# Altium schematic sheet OZ440-SE100-CAR003_sheet17.SchDoc
size A3
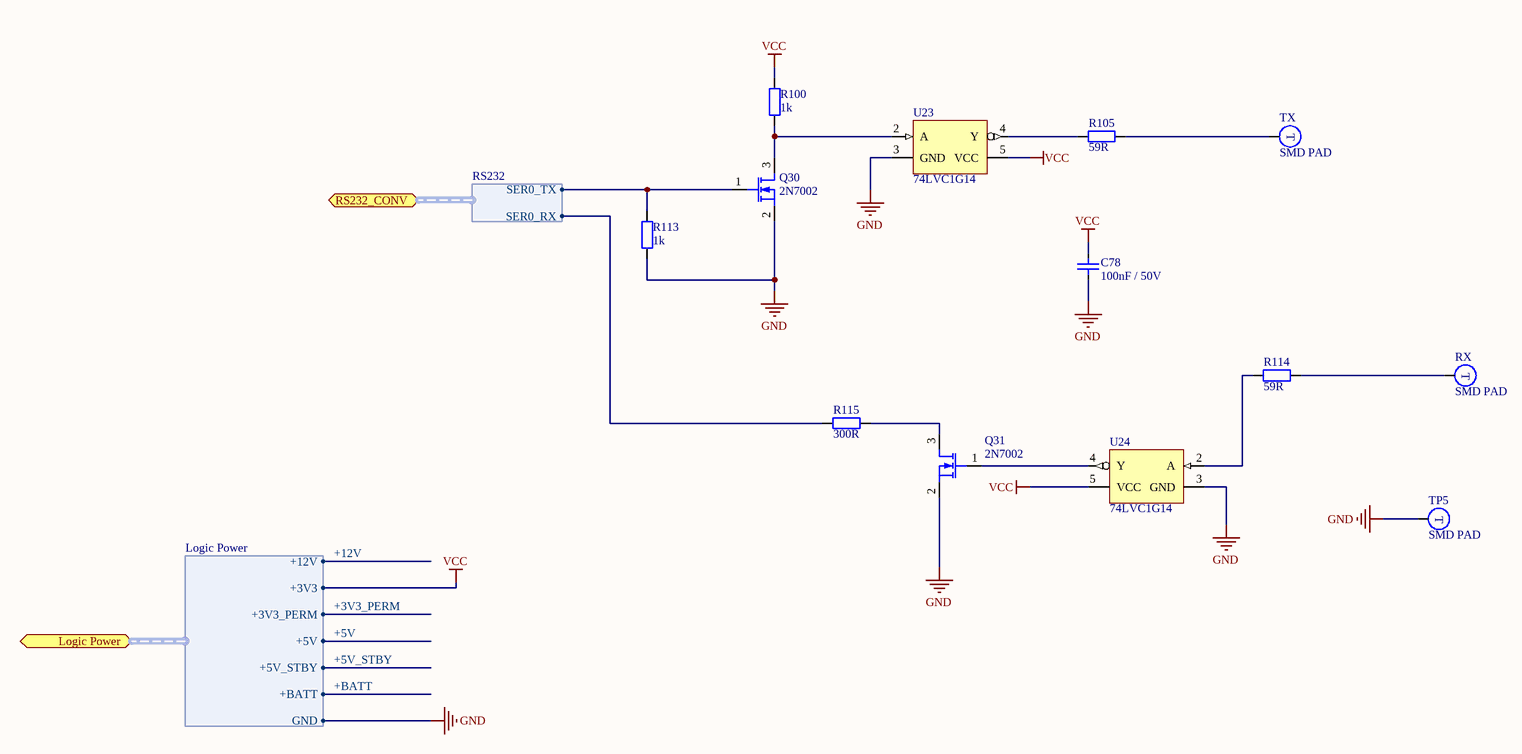
[diagram p0: OZ440-SE100-CAR003_sheet17.SchDoc]

## Parts
C78  Displayed reference: 100nF / 50V  [C0805-STD]  (hidden comment: CAP-SMD)
Q30  Displayed reference: 2N7002  [SOT23-SPE-2N7002]  (hidden comment: 2N7002-SMD3P)
Q31  Displayed reference: 2N7002  [SOT23-SPE-2N7002]  (hidden comment: 2N7002-SMD3P)
R100  Displayed reference: 1k  [R0805-STD]  (hidden comment: RES-SMD)
R105  Displayed reference: 59R  [R0805-STD]  (hidden comment: RES-SMD)
R113  Displayed reference: 1k  [R0805-STD]  (hidden comment: RES-SMD)
R114  Displayed reference: 59R  [R0805-STD]  (hidden comment: RES-SMD)
R115  Displayed reference: 300R  [R0805-STD]  (hidden comment: RES-SMD)
RX  Displayed reference: SMD PAD  [MEC-STD-SMD_PAD_2mm]  (hidden comment: TP-STD-TEST_POINT)  (no BOM)
TP5  Displayed reference: SMD PAD  [MEC-STD-SMD_PAD_2mm]  (hidden comment: TP-STD-TEST_POINT)  (no BOM)
TX  Displayed reference: SMD PAD  [MEC-STD-SMD_PAD_2mm]  (hidden comment: TP-STD-TEST_POINT)  (no BOM)
U23  Displayed reference: 74LVC1G14  [SOT353-1_5pin-STD]  (hidden comment: 74xxx1G14GW-SOT353-1)
U24  Displayed reference: 74LVC1G14  [SOT353-1_5pin-STD]  (hidden comment: 74xxx1G14GW-SOT353-1)

## Ports
Logic Power (harness Logic Power), RS232_CONV (harness RS232)

## Harnesses
RS232: SER0_RX, SER0_TX
Logic Power: +12V, +3V3, +3V3_PERM, +5V, +5V_STBY, +BATT, GND

## Nets
GND: C78.1 Q30.2(S) Q31.2(S) R113.1 TP5.1(T) U23.3(GND) U24.3(GND) ; port Logic Power.GND
VCC: C78.2 R100.2 U23.5(VCC) U24.5(VCC) ; port Logic Power.+3V3
+3V3_PERM: port Logic Power.+3V3_PERM
+5V: port Logic Power.+5V
+5V_STBY: port Logic Power.+5V_STBY
+12V: port Logic Power.+12V
+BATT: port Logic Power.+BATT
NetQ30_1: Q30.1(G) R113.2 ; port RS232_CONV.SER0_TX
NetQ30_3: Q30.3(D) R100.1 U23.2(A)
NetQ31_1: Q31.1(G) U24.4(Y)
NetQ31_3: Q31.3(D) R115.1
NetR105_1: R105.1 U23.4(Y)
NetR105_2: R105.2 TX.1(T)
NetR114_1: R114.1 U24.2(A)
NetR114_2: R114.2 RX.1(T)
NetR115_2: R115.2 ; port RS232_CONV.SER0_RX

## Notes on the sheet
- Titre document:
- NAIO TECHNOLOGIES
- 3 Av didier Daurat
- 31400 TOULOUSE
- Auteur:
- Numéro document:
- Verificateur:
- Format:
- A3
- Date:
- Revision:
- Page:
- /

## Library data of the parts
C78 = VJ0805Y104KXAxx: 0805 100nF / 50V  X7R ceramic capacitor; Manufacturer: vishay; Max Voltage: 50; Tolerance: +/- 10%; Validated: N; Reference: VJ0805Y104KXAxx; Value: 100nF; Material: X7R; Footprint description: standard Capacitor 0805; Pin Count: 2; helpURL: http://www.vishay.com/docs/45200/highrels.pdf; Supplier 1: Farnell; Supplier Part Number 1: 1612208; Supplier 2: Digi-Key; Supplier Part Number 2: 720-1266-6-ND
Q30 Q31 = 2N7002: N-Channel Enhancement Mode Field Effect Transistor; Manufacturer: FAIRCHILD; Max Voltage: 60 V; Max Current: 0,4 A; Rated Power: 0,2 W; Validated: False; Reference: 2N7002; component type: NMOS; Footprint description: SOT23; Pin Count: 3; Rev: A1; helpURL: http://www.fairchildsemi.com/ds/2N/2N7000.pdf; Supplier 1: Farnell; Supplier Part Number 1: 9845313; Supplier 2: Newark; Supplier Part Number 2: 58K9651
R100 R113 = CRCW08051K00FKxx: 1k Ohm 0805 SMD resistor; Manufacturer: Vishay; Value: 1 000; Tolerance: 1 %; Rated Power: 0,125 W; Validated: No; Reference: CRCW08051K00FKxx; Footprint description: standard 0805 SMD; Pin Count: 2; helpURL: http://www.vishay.com/docs/20035/dcrcwe3.pdf; Supplier 1: Farnell; Supplier Part Number 1: 1469847; Supplier 2: Mouser; Supplier Part Number 2: 71-CRCW0805-1.0K-E3
R105 R114 = CRCW080559R0FKxx: 59 Ohm 0805 SMD resistor; Manufacturer: Vishay; Value: 59; Tolerance: 1 %; Rated Power: 0.125 W; Validated: No; Reference: CRCW080559R0FKxx; Footprint description: standard 0805 SMD; Pin Count: 2; helpURL: http://www.vishay.com/docs/20035/dcrcwe3.pdf; Supplier 1: Mouser; Supplier Part Number 1: 71-CRCW080559R0FKEA; Supplier 2: Farnell; Supplier Part Number 2: 2138817
R115 = CRCW0805300RFKxx: 300 ohm 0805 SMD resistor; Manufacturer: Vishay; Value: 300; Tolerance: 1%; Rated Power: 0.125W; Validated: No; Reference: CRCW0805300RFKxx; Footprint description: standard 0805 SMD; Pin Count: 2; helpURL: http://www.vishay.com/docs/20035/dcrcwe3.pdf; Supplier 1: Mouser; Supplier Part Number 1: 71-CRCW0805300RFKEA; Supplier 2: Farnell; Supplier Part Number 2: 1152346
RX TP5 TX = SMD Pad: SMD Pad for wire soldering; Validated: False; Reference: SMD Pad; Footprint description: Smd pad; Pin Count: 1
U23 U24 = 74LVC1G14GW: smith trigger inverter; Manufacturer: NXP; Max Voltage: 5,5V; Validated: False; Reference: 74LVC1G14GW; Footprint description: SOT353-1, 5 pin; Pin Count: 5; helpURL: http://www.nxp.com/documents/data_sheet/74LVC1G14.pdf; Supplier 1: Farnell; Supplier Part Number 1: 1631687; Supplier 2: Digi-Key; Supplier Part Number 2: 568-2267-1-ND